# Altium schematic sheet deepshark_pwm_power.SchDoc
size A4
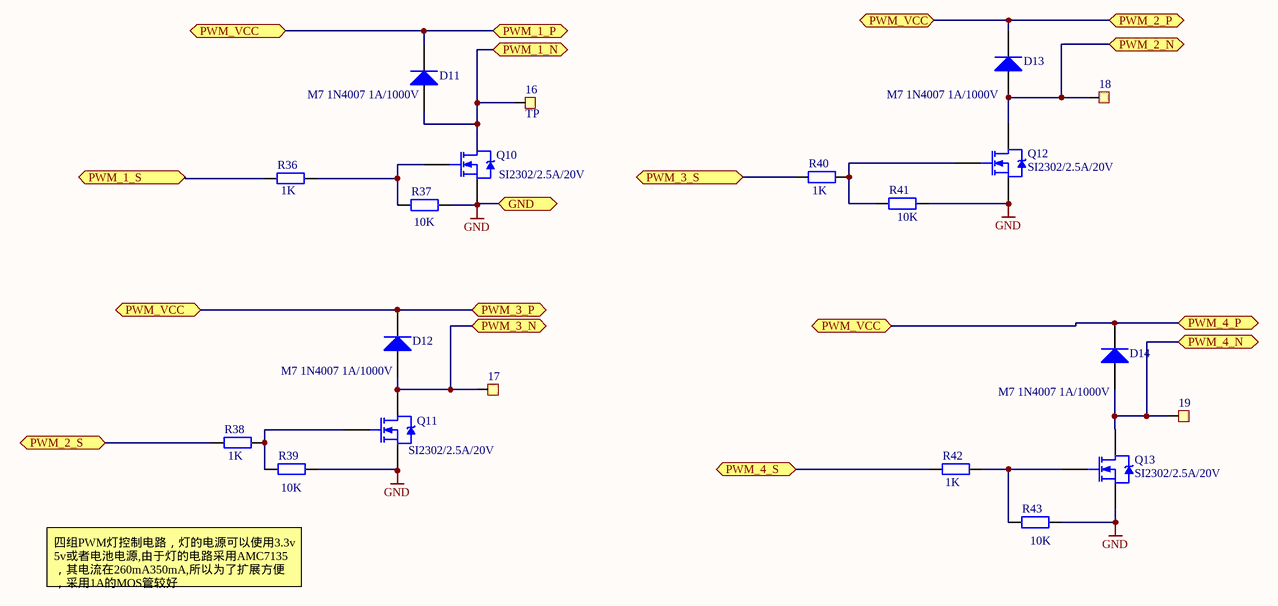
[diagram p0: deepshark_pwm_power.SchDoc]

## Parts
16  TP  [TestPoint]
17  TP  [TestPoint]  (value not drawn)
18  TP  [TestPoint]  (value not drawn)
19  TP  [TestPoint]  (value not drawn)
D11  M7 1N4007 1A/1000V  [M7-1n4007]
D12  M7 1N4007 1A/1000V  [M7-1n4007]
D13  M7 1N4007 1A/1000V  [M7-1n4007]
D14  M7 1N4007 1A/1000V  [M7-1n4007]
Q10  SI2302/2.5A/20V  [SOT23_M]
Q11  SI2302/2.5A/20V  [SOT23_M]
Q12  SI2302/2.5A/20V  [SOT23_M]
Q13  SI2302/2.5A/20V  [SOT23_M]
R36  value 1K  [6-0805_M]  (hidden comment: Res2)
R37  value 10K  [6-0805_M]  (hidden comment: Res2)
R38  value 1K  [6-0805_M]  (hidden comment: Res2)
R39  value 10K  [6-0805_M]  (hidden comment: Res2)
R40  value 1K  [6-0805_M]  (hidden comment: Res2)
R41  value 10K  [6-0805_M]  (hidden comment: Res2)
R42  value 1K  [6-0805_M]  (hidden comment: Res2)
R43  value 10K  [6-0805_M]  (hidden comment: Res2)

## Ports
GND, PWM_1_N, PWM_1_P, PWM_1_S, PWM_2_N, PWM_2_P, PWM_2_S, PWM_3_N, PWM_3_P, PWM_3_S, PWM_4_N, PWM_4_P, PWM_4_S, PWM_VCC

## Nets
GND: Q10.3(S) Q11.3(S) Q12.3(S) Q13.3(S) R37.2 R39.2 R41.2 R43.2 ; port GND
PWM_1_N: 16.1 D11.1(A) Q10.2(D) ; port PWM_1_N
PWM_1_P: D11.2(K) D12.2(K) D13.2(K) D14.2(K) ; port PWM_VCC, port PWM_1_P, port PWM_2_P, port PWM_3_P, port PWM_4_P
PWM_1_S: R36.1 ; port PWM_1_S
PWM_2_N: 18.1 D13.1(A) Q12.2(D) ; port PWM_2_N
PWM_2_S: R38.1 ; port PWM_2_S
PWM_3_N: 17.1 D12.1(A) Q11.2(D) ; port PWM_3_N
PWM_3_S: R40.1 ; port PWM_3_S
PWM_4_N: 19.1 D14.1(A) Q13.2(D) ; port PWM_4_N
PWM_4_S: R42.1 ; port PWM_4_S
NetQ10_1: Q10.1(G) R36.2 R37.1
NetQ11_1: Q11.1(G) R38.2 R39.1
NetQ12_1: Q12.1(G) R40.2 R41.1
NetQ13_1: Q13.1(G) R42.2 R43.1

## Notes on the sheet
- 四组PWM灯控制电路，灯的电源可以使用3.3v 5v或者电池电源,由于灯的电路采用AMC7135，其电流在260mA350mA,所以为了扩展方便，采用1A的MOS管较好

## Library data of the parts
D11-D14 = Diode: Default Diode; Published: 8-Jun-2000; LatestRevisionDate: 17-Jul-2002; LatestRevisionNote: Re-released for DXP Platform.; PackageVersion: Sep-1996; PackageReference: SMC; Publisher: Altium Limited; PackageDescription: DO-214-AB/SMC; 2 C-Bend Leads; Body 7.9 x 5.9 mm, inc. leads (LxW); Code_JEDEC: DO-214-AB
Q10-Q13 = NMOS-2: N-Channel Power MOSFET; pin to pad: 1>3 2>1 3>2; Note: Pin 2 is electrically connected to pin 4.; Published: 8-Jun-2000; LatestRevisionDate: 17-Jul-2002; LatestRevisionNote: Re-released for DXP Platform.; DatasheetVersion: PD-9.814; PackageVersion: Feb-1997; PackageReference: TO-220AB; Publisher: Altium Limited; PackageDescription: TO, Thru-Hole, Vertical, Heatsink Mounted; 3 In-Line Leads; Pitch 2.54 mm; ComponentLink1Description: Manufacturer Link; ComponentLink1URL: http://www.irf.com/
R36-R43 = Res2: Resistor; Published: 8-Jun-2000; LatestRevisionDate: 17-Jul-2002; LatestRevisionNote: Re-released for DXP Platform.; PackageReference: AXIAL-0.4; Publisher: Altium Limited; PackageDescription: Axial Device, Thru-Hole; 2 Leads; 0.4 in Pin Spacing